# EAGLE design spectrometer-shield (EAGLE 9.6.2)
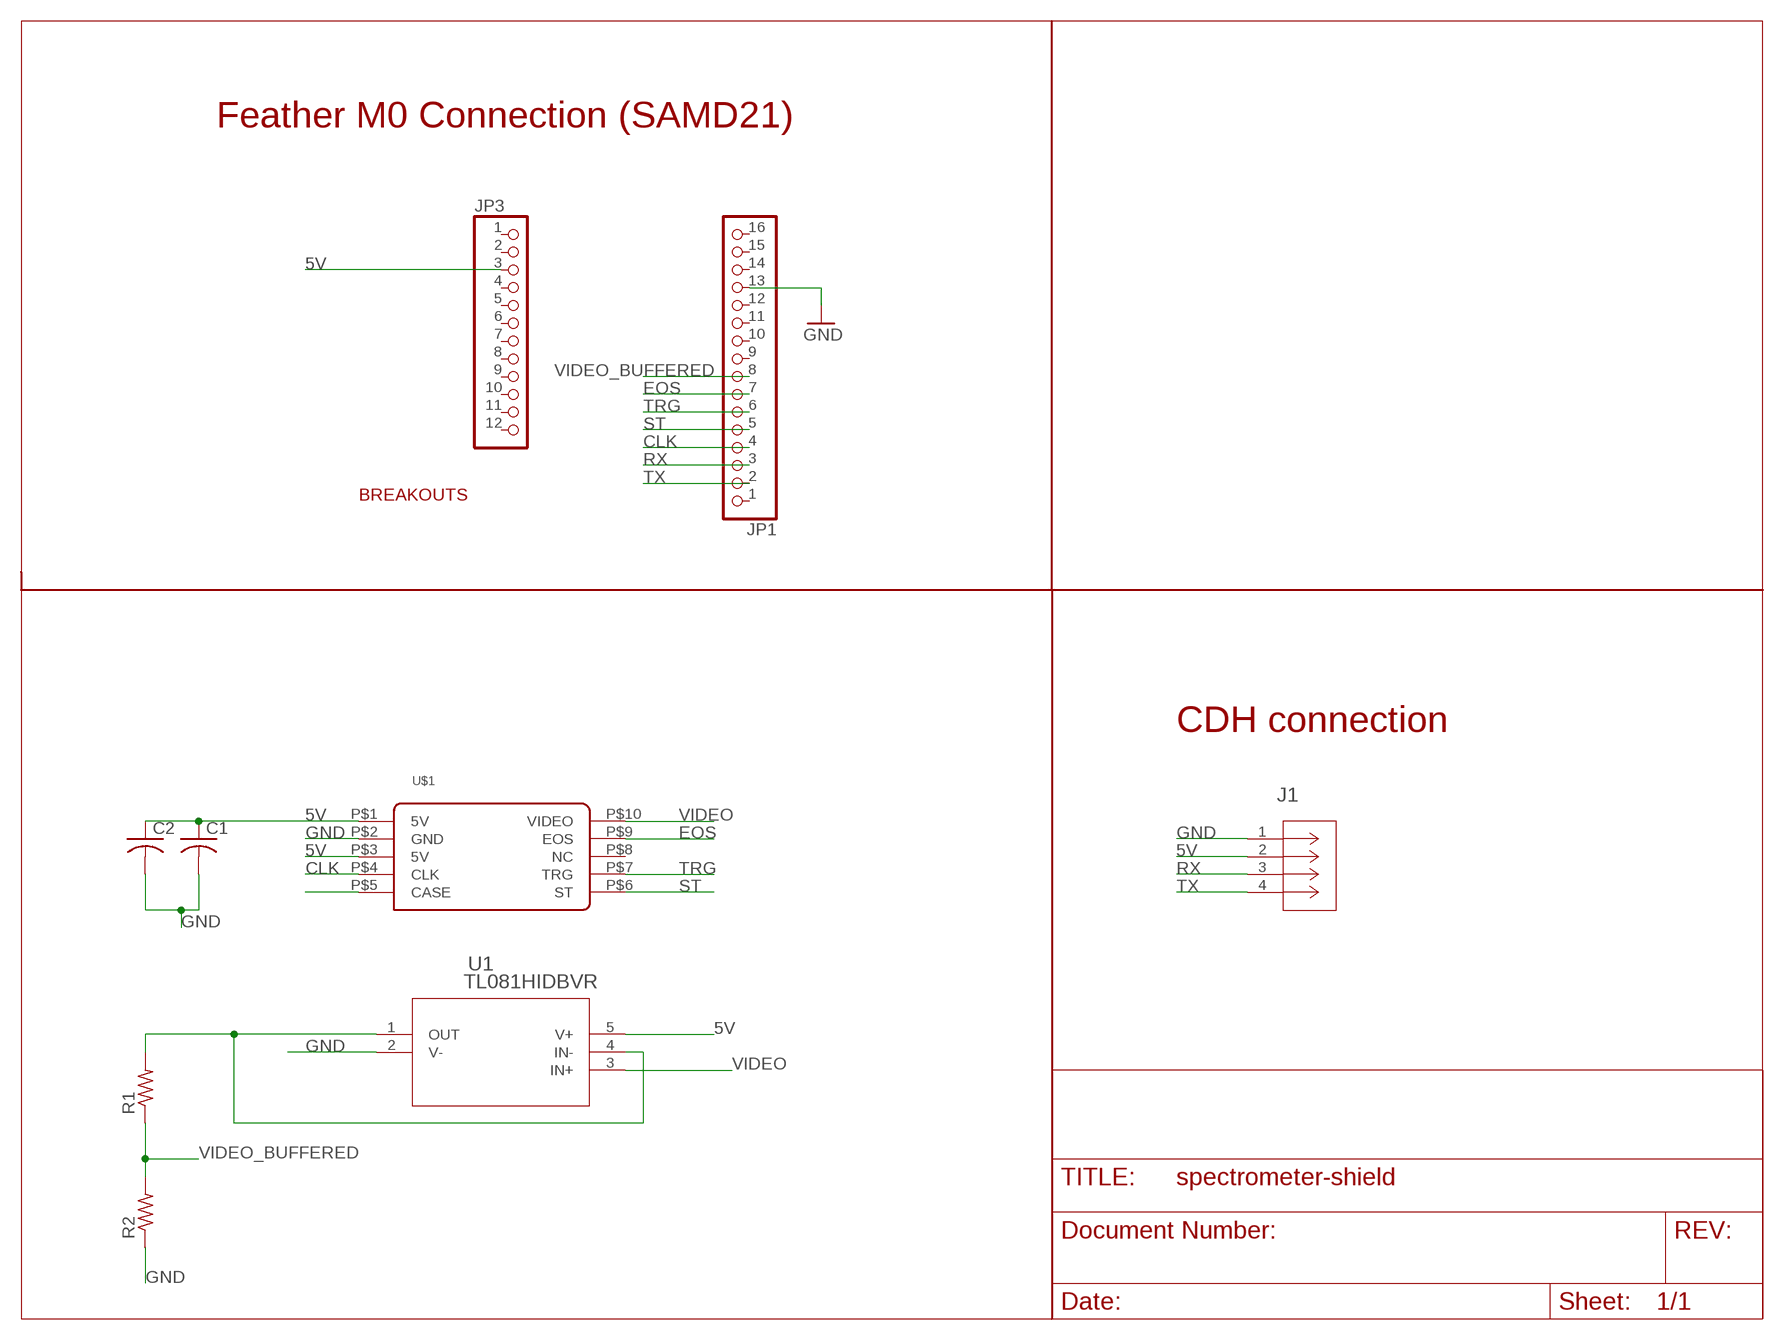
[diagram p0: schematic, sheet 1]

## Parts
C1  C-USC1206  [C1206]
C2  C-USC0603  [C0603]
J1  S4B-PH-SM4-TB(LF)(SN)  [CONN_S4B-PH-SM4-TB(LF)(SN)_JST]
JP1  HEADER-1X16ROUND  [1X16_ROUND]
JP3  HEADER-1X12  [1X12_ROUND]
R1  R-US_R0603  [R0603]
R2  R-US_R0603  [R0603]
U1  TL081HIDBVR  [SOT-23-5_DBV_TEX]
U$1  C12880MA  [C12880MA_FOOTPRINT]

## Nets
5V: C1.1 C2.1 J1.2 JP3.3 U1.5(V+) U$1.P$1(5V) U$1.P$3(5V)
CLK: JP1.4 U$1.P$4(CLK)
EOS: JP1.7 U$1.P$9(EOS)
GND: C1.2 C2.2 J1.1 JP1.13 R2.1 U1.2(V-) U$1.P$2(GND) U$1.P$5(CASE)
N$7: R1.2 U1.1(OUT) U1.4(IN-)
RX: J1.3 JP1.3
ST: JP1.5 U$1.P$6(ST)
TRG: JP1.6 U$1.P$7(TRG)
TX: J1.4 JP1.2
VIDEO: U1.3(IN+) U$1.P$10(VIDEO)
VIDEO_BUFFERED: JP1.8 R1.1 R2.2
Unconnected: JP1.1 JP1.9 JP1.10 JP1.11 JP1.12 JP1.14 JP1.15 JP1.16 JP3.1 JP3.2 JP3.4 JP3.5 JP3.6 JP3.7 JP3.8 JP3.9 JP3.10 JP3.11 JP3.12 U$1.P$8(NC)

## Notes on the sheet
- Feather M0 Connection (SAMD21)
- BREAKOUTS
- CDH connection

## Library data of the parts
C1 C2 = rcl:C-US: CAPACITOR, American symbol; SPICEPREFIX: C
J1 = COM-13909:S4B-PH-SM4-TB(LF)(SN); COPYRIGHT: Copyright (C) 2022 Ultra Librarian. All rights reserved.; DIGI-KEY_PART_NUMBER_1: 455-1751-2-ND; DIGI-KEY_PART_NUMBER_2: 455-1751-1-ND; DIGI-KEY_PART_NUMBER_3: 455-1751-6-ND; MANUFACTURER_PART_NUMBER: S4B-PH-SM4-TB(LF)(SN); MFR_NAME: JST
JP1 = microbuilder:HEADER-1X16: PIN HEADER
JP3 = microbuilder:HEADER-1X12
R1 R2 = rcl:R-US_: RESISTOR, American symbol; SPICEPREFIX: R
U1 = COM-13909:TL081HIDBVR; COPYRIGHT: Copyright (C) 2022 Ultra Librarian. All rights reserved.; DIGI-KEY_PART_NUMBER_1: 296-TL081HIDBVRTR-ND; DIGI-KEY_PART_NUMBER_2: 296-TL081HIDBVRCT-ND; DIGI-KEY_PART_NUMBER_3: 296-TL081HIDBVRDKR-ND; MANUFACTURER_PART_NUMBER: TL081HIDBVR; MFR_NAME: Texas Instruments
U$1 = COM-13909:C12880MA

## Net classes
2 gnd: width 0.254 mm

## Board
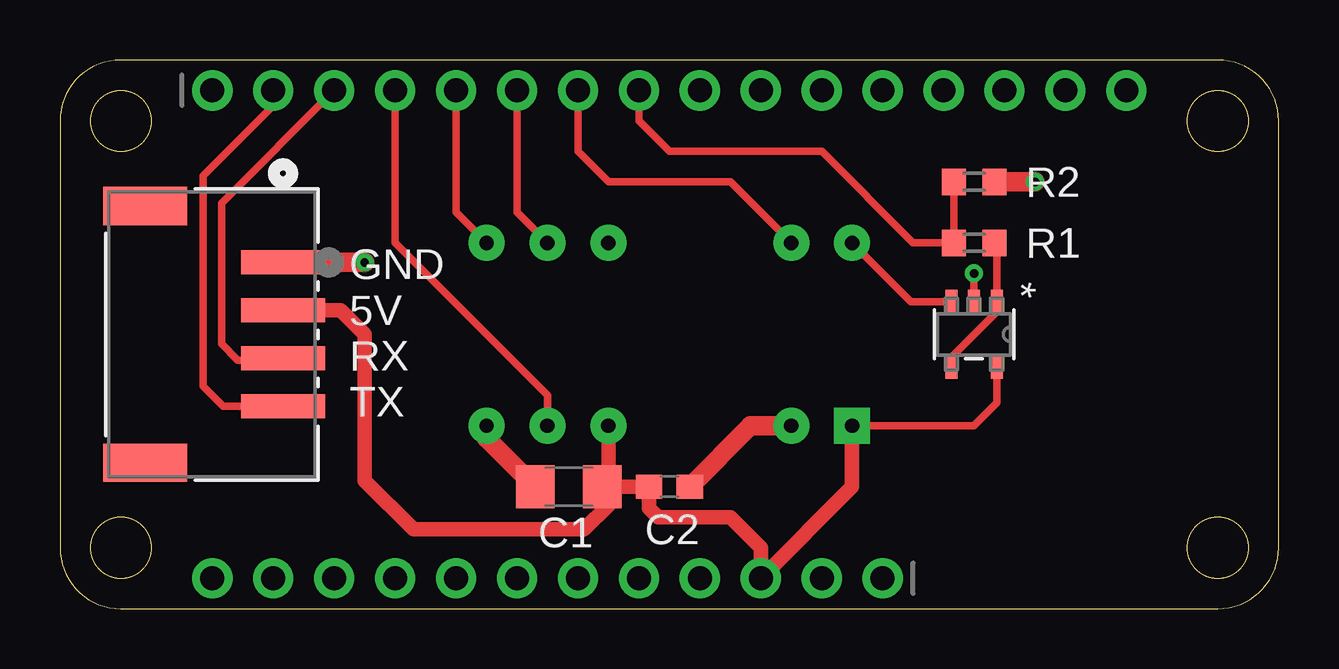
[diagram p1: board, top side]
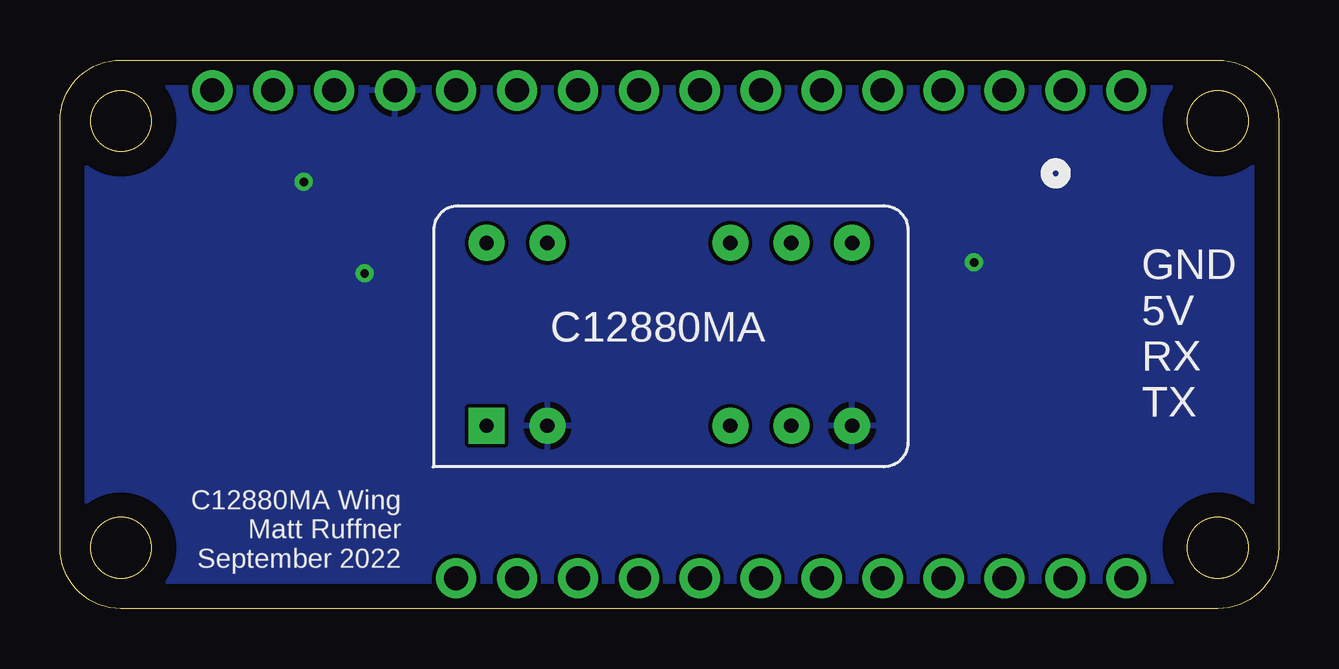
[diagram p2: board, bottom side, seen from below]

Size 50.8 x 22.86 mm. Coordinates in mm from the lower left corner, seen from the top.
Outline: 0,20.32 0,2.54 arc90 2.54,0 48.26,0 arc90 50.8,2.54 50.8,20.32 arc90 48.26,22.86 2.54,22.86 arc90 0,20.32
Outline: circle at 2.54,20.32 radius 1.27
Outline: circle at 2.54,2.54 radius 1.27
Outline: circle at 48.26,20.32 radius 1.27
Outline: circle at 48.26,2.54 radius 1.27
Copper layers (1*16): Top 0.035mm / dielectric 1.53mm / Bottom 0.035mm
Design rules "default *": minimum track width 6mil, minimum drill 0.35mm, track to track 6mil, track to pad 6mil, pad to pad 6mil, via to via 6mil, smd to smd 6mil, copper to edge 40mil, drill to drill 6mil, minimum pad ring 10mil, minimum via ring 8mil, stop-mask expansion 4mil, vias tented up to drill 14mil, thermal gap 10mil

### Footprints (pad centres in the part's own frame; a part is rotated, then mirrored left to right if it is on the bottom)
C1206 = smd 1.6 x 1.8: 1 -1.4,0; 2 1.4,0
C0603 = smd 1.1 x 1: 1 -0.85,0; 2 0.85,0
CONN_S4B-PH-SM4-TB(LF)(SN)_JST = smd 0.991 x 3.505: 1 3,-2.945; 2 1,-2.945; 3 -1,-2.945; 4 -3,-2.945 | smd 1.6 x 3.505: 5 -5.35,2.805; 6 5.35,2.805
1X16_ROUND = drill 1 pad 1.676: 1 -19.05,0; 2 -16.51,0; 3 -13.97,0; 4 -11.43,0; 5 -8.89,0; 6 -6.35,0; 7 -3.81,0; 8 -1.27,0; 9 1.27,0; 10 3.81,0; 11 6.35,0; 12 8.89,0; 13 11.43,0; 14 13.97,0; 15 16.51,0; 16 19.05,0
1X12_ROUND = drill 1 pad 1.676: 1 -13.97,0; 2 -11.43,0; 3 -8.89,0; 4 -6.35,0; 5 -3.81,0; 6 -1.27,0; 7 1.27,0; 8 3.81,0; 9 6.35,0; 10 8.89,0; 11 11.43,0; 12 13.97,0
R0603 = smd 1 x 1.1: 1 -0.85,0; 2 0.85,0
SOT-23-5_DBV_TEX = smd 0.978 x 0.508: 1 -1.365,0.95; 2 -1.365,0; 3 -1.365,-0.95; 4 1.365,-0.95; 5 1.365,0.95
C12880MA_FOOTPRINT = drill 0.6 pad 1.5 square: P$1 0,0 | drill 0.6 pad 1.5: P$2 2.54,0; P$3 10.16,0; P$4 12.7,0; P$5 15.24,0; P$6 15.24,7.62; P$7 12.7,7.62; P$8 10.16,7.62; P$9 2.54,7.62; P$10 0,7.62

### Placement (x,y rotation side)
C1  21.21,5.08 180 top
C2  25.4,5.08 0 top
J1  6.35,11.43 90 top
JP1  25.4,21.59 0 top
JP3  20.32,1.27 180 top
R1  38.1,15.24 0 top
R2  38.1,17.78 180 top
U1  38.1,11.43 270 top
U$1  33.02,7.62 0 bottom

### Tracks (layer width: path | path; a pad name or v marks a point on that pad's centre or on a via)
5V
  Top 0.305: U$1.P$1 38.1,7.62 39.05,8.57 U1.5 | 22.86,4.32 22.86,5.08 C1.1
  Top 0.61: U$1.P$1 33.02,5.08 JP3.3 29.21,2.54 27.94,3.81 24.93,3.81 24.55,4.19 C2.1 C1.1 | J1.2 11.7,12.43 12.7,11.43 12.7,5.33 14.73,3.3 21.84,3.3 22.86,4.32 | 22.86,5.08 U$1.P$3
CLK
  Top 0.305: U$1.P$4 20.32,8.89 13.97,15.24 JP1.4
EOS
  Top 0.305: U$1.P$9 27.94,17.78 22.86,17.78 21.59,19.05 JP1.7
GND  (via drill 0.35)
  Top 0.305: U1.2 v38.1,13.97
  Top 0.813: J1.1 v12.7,14.43 | R2.1 v40.64,17.78 | C1.2 17.78,7.11 U$1.P$5 | C2.2 28.79,7.62 U$1.P$2
  pour Bottom: 0,24.13 52.07,24.13 52.07,0 50.8,-1.27 0,-1.27 -1.27,0 -1.27,22.86
N$7
  Top 0.305: U1.4 37.15,10.48 39.05,12.38 U1.1 39.05,15.14 R1.2
RX
  Top 0.305: J1.3 9.22,10.36 7.42,10.36 6.73,11.05 6.73,16.89 JP1.3
ST
  Top 0.305: U$1.P$6 16.51,16.51 JP1.5
TRG
  Top 0.305: U$1.P$7 19.05,16.51 JP1.6
TX
  Top 0.305: JP1.2 8.89,20.95 5.97,18.03 5.97,9.27 6.81,8.43 J1.4
VIDEO
  Top 0.305: U$1.P$10 35.47,12.79 U1.3
VIDEO_BUFFERED
  Top 0.305: JP1.8 24.13,20.32 25.4,19.05 31.75,19.05 35.56,15.24 R1.1 R2.2

### Text on the board
tNames: GND / 5V / RX / TX
bNames: GND / 5V / RX / TX | C12880MA Wing / Matt Ruffner / September 2022